# EAGLE design LED (EAGLE 7.2.0)
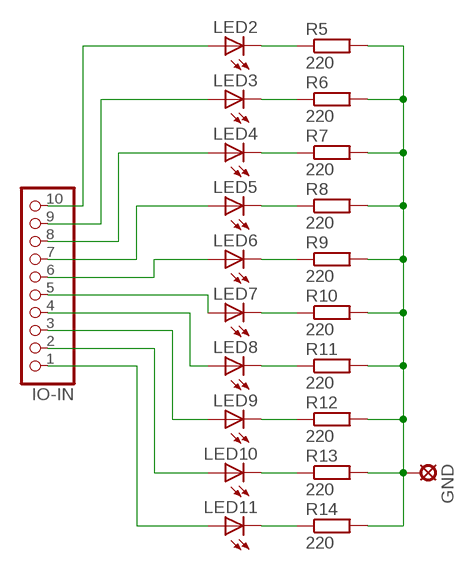
[diagram p0: schematic, sheet 1]

## Parts
GND  LSP10  [LSP10]
IO-IN  PINHD-1X10  [1X10]
LED2  LED3MM  [LED3MM]
LED3  LED3MM  [LED3MM]
LED4  LED3MM  [LED3MM]
LED5  LED3MM  [LED3MM]
LED6  LED3MM  [LED3MM]
LED7  LED3MM  [LED3MM]
LED8  LED3MM  [LED3MM]
LED9  LED3MM  [LED3MM]
LED10  LED3MM  [LED3MM]
LED11  LED3MM  [LED3MM]
R5  220  R-EU_0207/10  [0207/10]
R6  220  R-EU_0207/10  [0207/10]
R7  220  R-EU_0207/10  [0207/10]
R8  220  R-EU_0207/10  [0207/10]
R9  220  R-EU_0207/10  [0207/10]
R10  220  R-EU_0207/10  [0207/10]
R11  220  R-EU_0207/10  [0207/10]
R12  220  R-EU_0207/10  [0207/10]
R13  220  R-EU_0207/10  [0207/10]
R14  220  R-EU_0207/10  [0207/10]

## Nets
N$41: LED2.K(C) R5.1
N$42: LED3.K(C) R6.1
N$43: LED4.K(C) R7.1
N$44: LED5.K(C) R8.1
N$45: LED6.K(C) R9.1
N$46: LED7.K(C) R10.1
N$47: LED8.K(C) R11.1
N$48: LED9.K(C) R12.1
N$49: LED10.K(C) R13.1
N$50: LED11.K(C) R14.1
N$52: IO-IN.10 LED2.A
N$53: IO-IN.9 LED3.A
N$54: IO-IN.8 LED4.A
N$55: IO-IN.7 LED5.A
N$56: IO-IN.6 LED6.A
N$57: IO-IN.5 LED7.A
N$58: IO-IN.4 LED8.A
N$59: IO-IN.3 LED9.A
N$60: IO-IN.2 LED10.A
N$61: IO-IN.1 LED11.A
N$123: GND.MP R5.2 R6.2 R7.2 R8.2 R9.2 R10.2 R11.2 R12.2 R13.2 R14.2

## Library data of the parts
GND = solpad:LSP10: SOLDER PAD drill 1.0 mm, distributor Buerklin, 12H555
IO-IN = pinhead:PINHD-1X10: PIN HEADER
LED2-LED11 = led:LED: LED OSRAM: - CHIPLED LG R971, LG N971, LY N971, LG Q971, LY Q971, LO R971, LY R971 LH N974, LH R974 LS Q976, LO Q976, LY Q976 LO Q996 - Hyper CHIPLED LW Q18S LB Q993, LB Q99A, LB R99A - SideLED LS A670, LO A670, LY A670, LG A670, LP A670 LB A673, LV A673, LT A673, LW A673 LH A674 LY A675 LS A676, LA A676, LO A676, LY A676, LW A676 LS A679, LY A679, LG A679 - Hyper Micro SIDELED® LS Y876, LA Y876, LO Y876, LY Y876 LT Y87S - SmartLED LW L88C, LW L88S LB L89C, LB L89S, LG L890 LS L89K, LO L89K, LY L89K LS L896, LA L896, LO L896, LY L896 - TOPLED LS T670, LO T670, LY T670, LG T670, LP T670 LSG T670, LSP T670, LSY T670, LOP T670, LYG T670 LG T671, LOG T671, LSG T671 LB T673, LV T673, LT T673, LW T673 LH T674 LS T676, LA T676, LO T676, LY T676, LB T676, LH T676, LSB T676, LW T676 LB T67C, LV T67C, LT T67C, LS T67K, LO T67K, LY T67K, LW E67C LS E67B, LA E67B, LO E67B, LY E67B, LB E67C, LV E67C, LT E67C LW T67C LS T679, LY T679, LG T679 LS T770, LO T770, LY T770, LG T770, LP T770 LB T773, LV T773, LT T773, LW T773 LH T774 LS E675, LA E675, LY E675, LS T675 LS T776, LA T776, LO T776, LY T776, LB T776 LHGB T686 LT T68C, LB T68C - Hyper Mini TOPLED® LB M676 - Mini TOPLED Santana® LG M470 LS M47K, LO M47K, LY M47K Source: http://www.osram.convergy.de LUXEON: - LUMILED® LXK2-PW12-R00, LXK2-PW12-S00, LXK2-PW14-U00, LXK2-PW14-V00 LXK2-PM12-R00, LXK2-PM12-S00, LXK2-PM14-U00 LXK2-PE12-Q00, LXK2-PE12-R00, LXK2-PE12-S00, LXK2-PE14-T00, LXK2-PE14-U00 LXK2-PB12-K00, LXK2-PB12-L00, LXK2-PB12-M00, LXK2-PB14-N00, LXK2-PB14-P00, LXK2-PB14-Q00 LXK2-PR12-L00, LXK2-PR12-M00, LXK2-PR14-Q00, LXK2-PR14-R00 LXK2-PD12-Q00, LXK2-PD12-R00, LXK2-PD12-S00 LXK2-PH12-R00, LXK2-PH12-S00 LXK2-PL12-P00, LXK2-PL12-Q00, LXK2-PL12-R00 Source: www.luxeon.com KINGBRIGHT: KA-3528ASYC Source: www.kingbright.com
R5-R14 = rcl:R-EU_: RESISTOR, European symbol

## Board
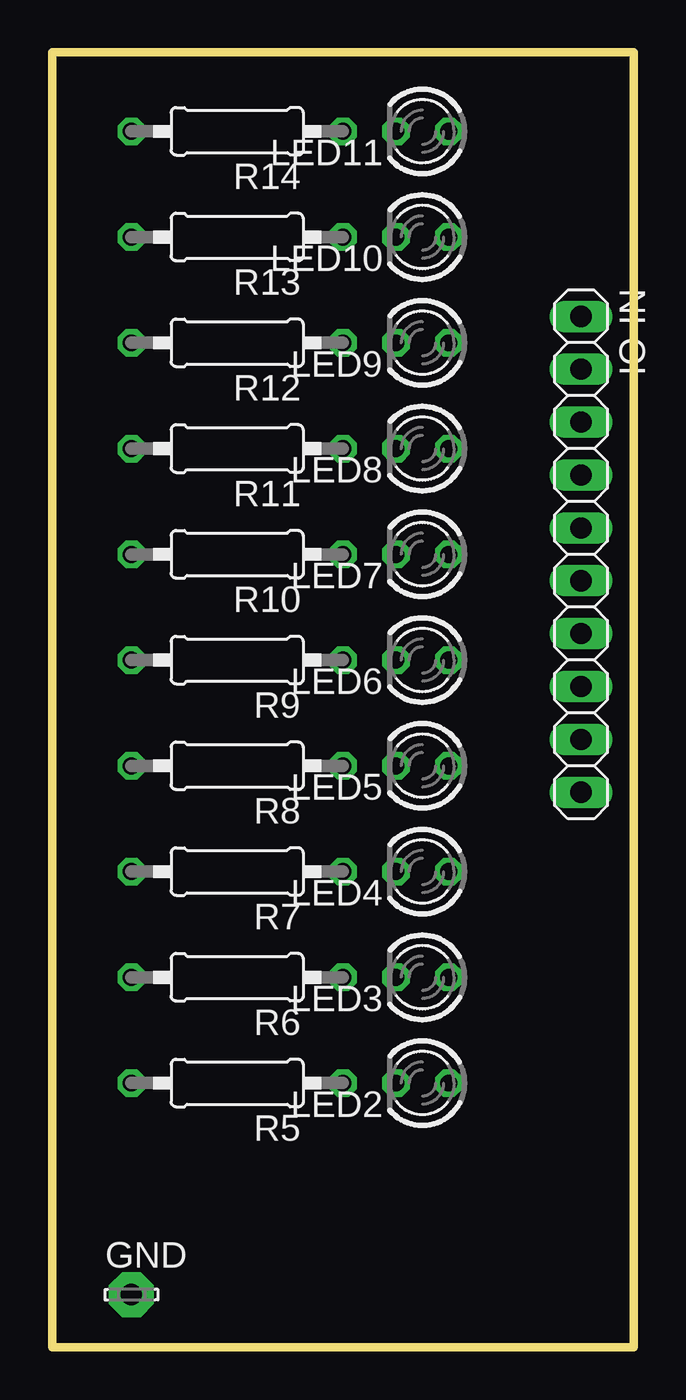
[diagram p1: board, top side]
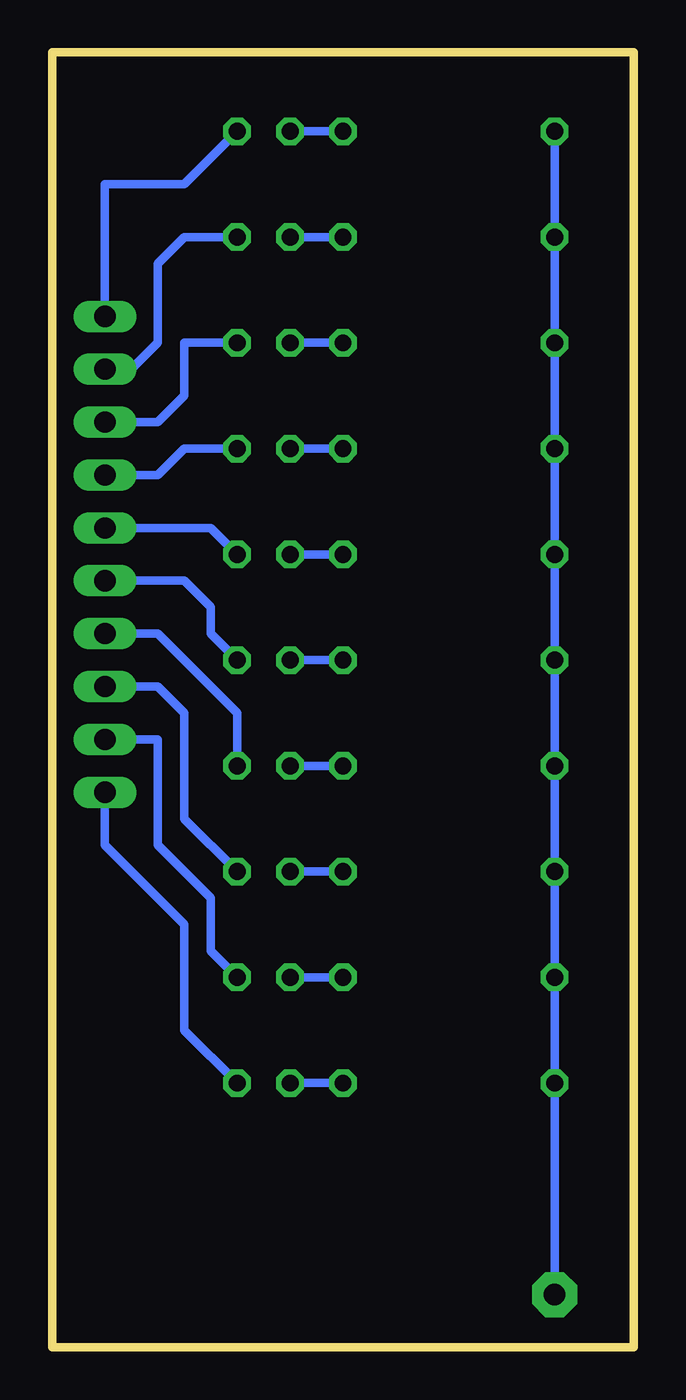
[diagram p2: board, bottom side, seen from below]

Size 27.94 x 62.23 mm. Coordinates in mm from the lower left corner, seen from the top.
Outline: 0,62.23 27.94,62.23 27.94,0 0,0 0,62.23
Copper layers (1*16): Top 0.035mm / dielectric 1.5mm / Bottom 0.035mm
Design rules "default": minimum track width 10mil, minimum drill 24mil, track to track 8mil, track to pad 8mil, pad to pad 8mil, via to via 8mil, smd to smd 8mil, copper to edge 40mil, drill to drill 8mil, minimum pad ring 10mil, minimum via ring 8mil, stop-mask expansion 4mil, vias tented up to drill 0mil, thermal gap 10mil

### Footprints (pad centres in the part's own frame; a part is rotated, then mirrored left to right if it is on the bottom)
LSP10 = drill 1.016 pad 2.159 octagon: MP 0,0
1X10 = drill 1.016 long: 1 -11.43,0; 2 -8.89,0; 3 -6.35,0; 4 -3.81,0; 5 -1.27,0; 6 1.27,0; 7 3.81,0; 8 6.35,0; 9 8.89,0; 10 11.43,0
LED3MM = drill 0.813 octagon: A -1.27,0; K 1.27,0
0207/10 = drill 0.813 octagon: 1 -5.08,0; 2 5.08,0

### Placement (x,y rotation side)
GND  3.81,2.54 0 top
IO-IN  25.4,38.1 270 top
LED2  17.78,12.7 180 top
LED3  17.78,17.78 180 top
LED4  17.78,22.86 180 top
LED5  17.78,27.94 180 top
LED6  17.78,33.02 180 top
LED7  17.78,38.1 180 top
LED8  17.78,43.18 180 top
LED9  17.78,48.26 180 top
LED10  17.78,53.34 180 top
LED11  17.78,58.42 180 top
R5  8.89,12.7 180 top
R6  8.89,17.78 180 top
R7  8.89,22.86 180 top
R8  8.89,27.94 180 top
R9  8.89,33.02 180 top
R10  8.89,38.1 180 top
R11  8.89,43.18 180 top
R12  8.89,48.26 180 top
R13  8.89,53.34 180 top
R14  8.89,58.42 180 top

### Tracks (layer width: path | path; a pad name or v marks a point on that pad's centre or on a via)
N$41
  Bottom 0.406: LED2.K R5.1
N$42
  Bottom 0.406: LED3.K R6.1
N$43
  Bottom 0.406: LED4.K R7.1
N$44
  Bottom 0.406: LED5.K R8.1
N$45
  Bottom 0.406: LED6.K R9.1
N$46
  Bottom 0.406: LED7.K R10.1
N$47
  Bottom 0.406: R11.1 LED8.K
N$48
  Bottom 0.406: R12.1 LED9.K
N$49
  Bottom 0.406: R13.1 LED10.K
N$50
  Bottom 0.406: R14.1 LED11.K
N$52
  Bottom 0.406: LED2.A 21.59,15.24 21.59,20.32 25.4,24.13 IO-IN.10
N$53
  Bottom 0.406: LED3.A 20.32,19.05 20.32,21.59 22.86,24.13 22.86,29.21 IO-IN.9
N$54
  Bottom 0.406: LED4.A 21.59,25.4 21.59,30.48 22.86,31.75 IO-IN.8
N$55
  Bottom 0.406: LED5.A 19.05,30.48 22.86,34.29 IO-IN.7
N$56
  Bottom 0.406: LED6.A 20.32,34.29 20.32,35.56 21.59,36.83 IO-IN.6
N$57
  Bottom 0.406: LED7.A 20.32,39.37 IO-IN.5
N$58
  Bottom 0.406: LED8.A 21.59,43.18 22.86,41.91 IO-IN.4
N$59
  Bottom 0.406: LED9.A 21.59,48.26 21.59,45.72 22.86,44.45 IO-IN.3
N$60
  Bottom 0.406: LED10.A 21.59,53.34 22.86,52.07 22.86,48.26 24.13,46.99 IO-IN.2
N$61
  Bottom 0.406: LED11.A 21.59,55.88 25.4,55.88 IO-IN.1
N$123
  Bottom 0.406: R14.2 R13.2 R12.2 R11.2 R10.2 R9.2 R8.2 R7.2 R6.2 R5.2 GND.MP